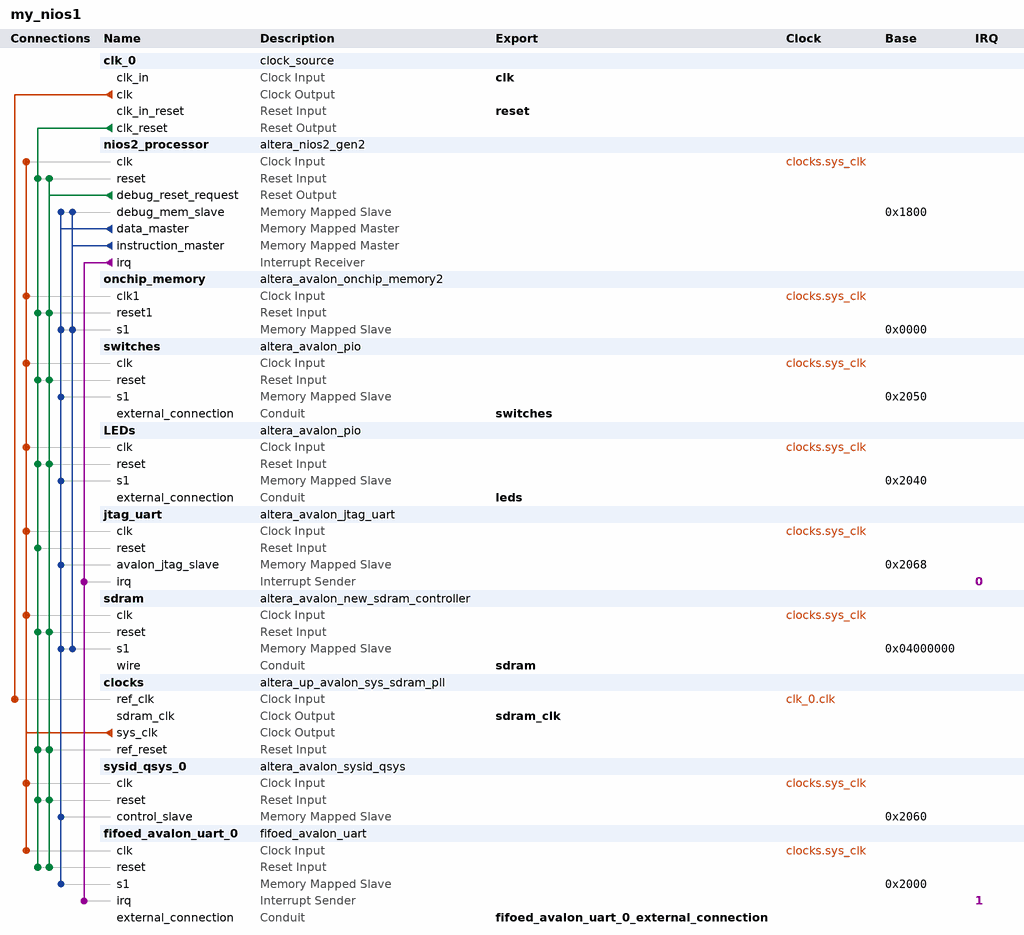
[diagram p0: system contents]
# Platform Designer (Qsys) system my_nios1, Cyclone IV E EP4CE22F17C6
# Parameters at their usual value, and those the tool derives, are not listed.
package require -exact qsys 18.1
create_system my_nios1
set_project_property DEVICE_FAMILY {Cyclone IV E}
set_project_property DEVICE EP4CE22F17C6

add_instance clk_0 clock_source 18.1
set_instance_parameter_value clk_0 clockFrequency 50000000

add_instance nios2_processor altera_nios2_gen2 18.1
set_instance_parameter_value nios2_processor dcache_size 2048
set_instance_parameter_value nios2_processor exceptionSlave sdram.s1
set_instance_parameter_value nios2_processor icache_size 4096
set_instance_parameter_value nios2_processor impl Tiny
set_instance_parameter_value nios2_processor resetSlave sdram.s1

add_instance onchip_memory altera_avalon_onchip_memory2 18.1
set_instance_parameter_value onchip_memory dataWidth 32
set_instance_parameter_value onchip_memory dualPort false
set_instance_parameter_value onchip_memory initMemContent true
set_instance_parameter_value onchip_memory initializationFileName onchip_mem.hex
set_instance_parameter_value onchip_memory memorySize 4096

add_instance switches altera_avalon_pio 18.1
set_instance_parameter_value switches direction Input
set_instance_parameter_value switches width 8

add_instance LEDs altera_avalon_pio 18.1
set_instance_parameter_value LEDs direction Output
set_instance_parameter_value LEDs width 8

add_instance jtag_uart altera_avalon_jtag_uart 18.1
set_instance_parameter_value jtag_uart simInteractiveOptions NO_INTERACTIVE_WINDOWS

add_instance sdram altera_avalon_new_sdram_controller 18.1
set_instance_parameter_value sdram TAC 5.5
set_instance_parameter_value sdram TRCD 20.0
set_instance_parameter_value sdram TRP 20.0
set_instance_parameter_value sdram casLatency 3
set_instance_parameter_value sdram columnWidth 9
set_instance_parameter_value sdram dataWidth 16
set_instance_parameter_value sdram generateSimulationModel false
set_instance_parameter_value sdram model single_Micron_MT48LC4M32B2_7_chip
set_instance_parameter_value sdram numberOfBanks 4
set_instance_parameter_value sdram numberOfChipSelects 1
set_instance_parameter_value sdram powerUpDelay 100.0
set_instance_parameter_value sdram refreshPeriod 15.625
set_instance_parameter_value sdram rowWidth 13

add_instance clocks altera_up_avalon_sys_sdram_pll 18.0
set_instance_parameter_value clocks CIV_boards DE0-Nano
set_instance_parameter_value clocks CV_boards DE1-SoC
set_instance_parameter_value clocks gui_outclk 50.0
set_instance_parameter_value clocks gui_refclk 50.0

add_instance sysid_qsys_0 altera_avalon_sysid_qsys 18.1
set_instance_parameter_value sysid_qsys_0 id 305419896

add_instance fifoed_avalon_uart_0 fifoed_avalon_uart 13.1
set_instance_parameter_value fifoed_avalon_uart_0 add_error_bits false
set_instance_parameter_value fifoed_avalon_uart_0 baud 115200
set_instance_parameter_value fifoed_avalon_uart_0 dataBits 8
set_instance_parameter_value fifoed_avalon_uart_0 driver_pass_error_bits false
set_instance_parameter_value fifoed_avalon_uart_0 export_handshake false
set_instance_parameter_value fifoed_avalon_uart_0 fifo_export_used false
set_instance_parameter_value fifoed_avalon_uart_0 fifo_size_rx 1024
set_instance_parameter_value fifoed_avalon_uart_0 fifo_size_tx 1024
set_instance_parameter_value fifoed_avalon_uart_0 fixedBaud true
set_instance_parameter_value fifoed_avalon_uart_0 gap_value 4
set_instance_parameter_value fifoed_avalon_uart_0 hw_cts false
set_instance_parameter_value fifoed_avalon_uart_0 parity NONE
set_instance_parameter_value fifoed_avalon_uart_0 rx_IRQ_Threshold 1
set_instance_parameter_value fifoed_avalon_uart_0 rx_fifo_LE false
set_instance_parameter_value fifoed_avalon_uart_0 simInteractiveInputEnable false
set_instance_parameter_value fifoed_avalon_uart_0 simInteractiveOutputEnable false
set_instance_parameter_value fifoed_avalon_uart_0 simTrueBaud false
set_instance_parameter_value fifoed_avalon_uart_0 stopBits 1
set_instance_parameter_value fifoed_avalon_uart_0 syncRegDepth 2
set_instance_parameter_value fifoed_avalon_uart_0 timeout_value 4
set_instance_parameter_value fifoed_avalon_uart_0 timestamp_width 8
set_instance_parameter_value fifoed_avalon_uart_0 trans_pin false
set_instance_parameter_value fifoed_avalon_uart_0 tx_IRQ_Threshold 1
set_instance_parameter_value fifoed_avalon_uart_0 tx_fifo_LE false
set_instance_parameter_value fifoed_avalon_uart_0 useCtsRts false
set_instance_parameter_value fifoed_avalon_uart_0 useEopRegister false
set_instance_parameter_value fifoed_avalon_uart_0 useRelativePathForSimFile false
set_instance_parameter_value fifoed_avalon_uart_0 use_ext_timestamp false
set_instance_parameter_value fifoed_avalon_uart_0 use_gap_detection false
set_instance_parameter_value fifoed_avalon_uart_0 use_rx_fifo true
set_instance_parameter_value fifoed_avalon_uart_0 use_status_bit_clear false
set_instance_parameter_value fifoed_avalon_uart_0 use_timestamp false
set_instance_parameter_value fifoed_avalon_uart_0 use_timout false
set_instance_parameter_value fifoed_avalon_uart_0 use_tx_fifo true

# connections
add_connection clk_0.clk clocks.ref_clk clock
add_connection clocks.sys_clk fifoed_avalon_uart_0.clk clock
add_connection clocks.sys_clk jtag_uart.clk clock
add_connection clocks.sys_clk LEDs.clk clock
add_connection clocks.sys_clk nios2_processor.clk clock
add_connection clocks.sys_clk onchip_memory.clk1 clock
add_connection clocks.sys_clk sdram.clk clock
add_connection clocks.sys_clk switches.clk clock
add_connection clocks.sys_clk sysid_qsys_0.clk clock
add_connection clk_0.clk_reset clocks.ref_reset reset
add_connection clk_0.clk_reset fifoed_avalon_uart_0.reset reset
add_connection clk_0.clk_reset jtag_uart.reset reset
add_connection clk_0.clk_reset LEDs.reset reset
add_connection clk_0.clk_reset nios2_processor.reset reset
add_connection clk_0.clk_reset onchip_memory.reset1 reset
add_connection clk_0.clk_reset sdram.reset reset
add_connection clk_0.clk_reset switches.reset reset
add_connection clk_0.clk_reset sysid_qsys_0.reset reset
add_connection nios2_processor.debug_reset_request clocks.ref_reset reset
add_connection nios2_processor.debug_reset_request fifoed_avalon_uart_0.reset reset
add_connection nios2_processor.debug_reset_request LEDs.reset reset
add_connection nios2_processor.debug_reset_request nios2_processor.reset reset
add_connection nios2_processor.debug_reset_request onchip_memory.reset1 reset
add_connection nios2_processor.debug_reset_request sdram.reset reset
add_connection nios2_processor.debug_reset_request switches.reset reset
add_connection nios2_processor.debug_reset_request sysid_qsys_0.reset reset
add_connection nios2_processor.data_master fifoed_avalon_uart_0.s1 avalon
set_connection_parameter_value nios2_processor.data_master/fifoed_avalon_uart_0.s1 baseAddress 0x2000
add_connection nios2_processor.data_master jtag_uart.avalon_jtag_slave avalon
set_connection_parameter_value nios2_processor.data_master/jtag_uart.avalon_jtag_slave baseAddress 0x2068
add_connection nios2_processor.data_master LEDs.s1 avalon
set_connection_parameter_value nios2_processor.data_master/LEDs.s1 baseAddress 0x2040
add_connection nios2_processor.data_master nios2_processor.debug_mem_slave avalon
set_connection_parameter_value nios2_processor.data_master/nios2_processor.debug_mem_slave baseAddress 0x1800
add_connection nios2_processor.data_master onchip_memory.s1 avalon
set_connection_parameter_value nios2_processor.data_master/onchip_memory.s1 baseAddress 0x0000
add_connection nios2_processor.data_master sdram.s1 avalon
set_connection_parameter_value nios2_processor.data_master/sdram.s1 baseAddress 0x04000000
add_connection nios2_processor.data_master switches.s1 avalon
set_connection_parameter_value nios2_processor.data_master/switches.s1 baseAddress 0x2050
add_connection nios2_processor.data_master sysid_qsys_0.control_slave avalon
set_connection_parameter_value nios2_processor.data_master/sysid_qsys_0.control_slave baseAddress 0x2060
add_connection nios2_processor.instruction_master nios2_processor.debug_mem_slave avalon
set_connection_parameter_value nios2_processor.instruction_master/nios2_processor.debug_mem_slave baseAddress 0x1800
add_connection nios2_processor.instruction_master onchip_memory.s1 avalon
set_connection_parameter_value nios2_processor.instruction_master/onchip_memory.s1 baseAddress 0x0000
add_connection nios2_processor.instruction_master sdram.s1 avalon
set_connection_parameter_value nios2_processor.instruction_master/sdram.s1 baseAddress 0x04000000
add_connection nios2_processor.irq fifoed_avalon_uart_0.irq interrupt
set_connection_parameter_value nios2_processor.irq/fifoed_avalon_uart_0.irq irqNumber 1
add_connection nios2_processor.irq jtag_uart.irq interrupt
set_connection_parameter_value nios2_processor.irq/jtag_uart.irq irqNumber 0

# exported interfaces
add_interface clk clock sink
set_interface_property clk EXPORT_OF clk_0.clk_in
add_interface fifoed_avalon_uart_0_external_connection conduit end
set_interface_property fifoed_avalon_uart_0_external_connection EXPORT_OF fifoed_avalon_uart_0.external_connection
add_interface leds conduit end
set_interface_property leds EXPORT_OF LEDs.external_connection
add_interface reset reset sink
set_interface_property reset EXPORT_OF clk_0.clk_in_reset
add_interface sdram conduit end
set_interface_property sdram EXPORT_OF sdram.wire
add_interface sdram_clk clock source
set_interface_property sdram_clk EXPORT_OF clocks.sdram_clk
add_interface switches conduit end
set_interface_property switches EXPORT_OF switches.external_connection

set_interconnect_requirement {$system} qsys_mm.clockCrossingAdapter HANDSHAKE
set_interconnect_requirement {$system} qsys_mm.enableEccProtection FALSE
set_interconnect_requirement {$system} qsys_mm.insertDefaultSlave FALSE
set_interconnect_requirement {$system} qsys_mm.maxAdditionalLatency 1

save_system my_nios1.qsys
